# EAGLE design main (EAGLE 9.6.2)
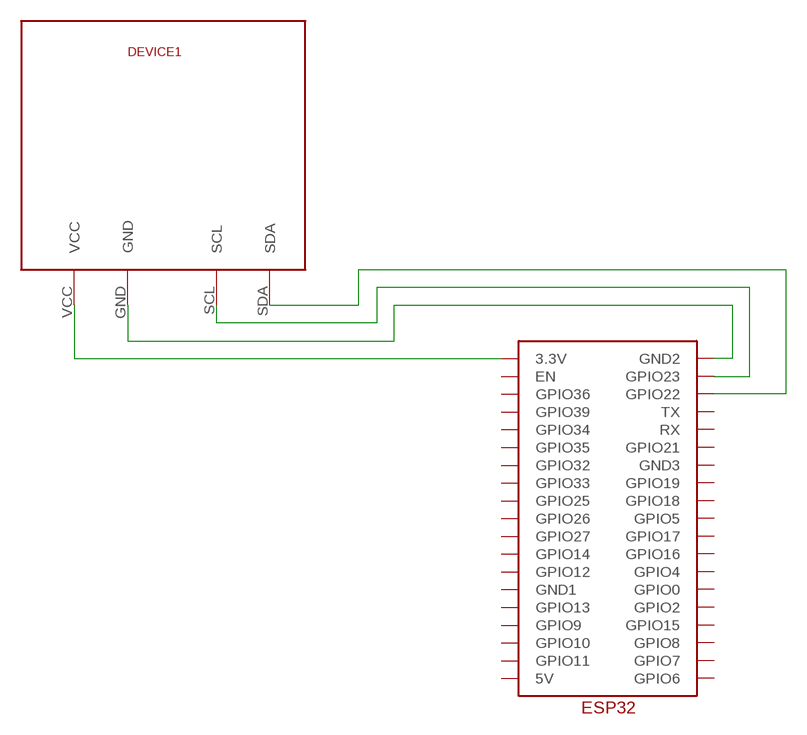
[diagram p0: schematic, sheet 1]

## Parts
U$1  DEVICE1  [HEADER_DEVICE1]
U$2  ESP32  [ESP32]

## Nets
GND: U$1.GND U$2.GND2
SCL: U$1.SCL U$2.GPIO23
SDA: U$1.SDA U$2.GPIO22
VCC: U$1.VCC U$2.3.3V
Unconnected: U$2.5V U$2.EN U$2.GND1 U$2.GND3 U$2.GPIO0 U$2.GPIO2 U$2.GPIO4 U$2.GPIO5 U$2.GPIO6 U$2.GPIO7 U$2.GPIO8 U$2.GPIO9 U$2.GPIO10 U$2.GPIO11 U$2.GPIO12 U$2.GPIO13 U$2.GPIO14 U$2.GPIO15 U$2.GPIO16 U$2.GPIO17 U$2.GPIO18 U$2.GPIO19 U$2.GPIO21 U$2.GPIO25 U$2.GPIO26 U$2.GPIO27 U$2.GPIO32 U$2.GPIO33 U$2.GPIO34 U$2.GPIO35 U$2.GPIO36 U$2.GPIO39 U$2.RX U$2.TX

## Library data of the parts
U$1 = my_devices:DEVICE1
U$2 = ESP32:ESP32

## Board
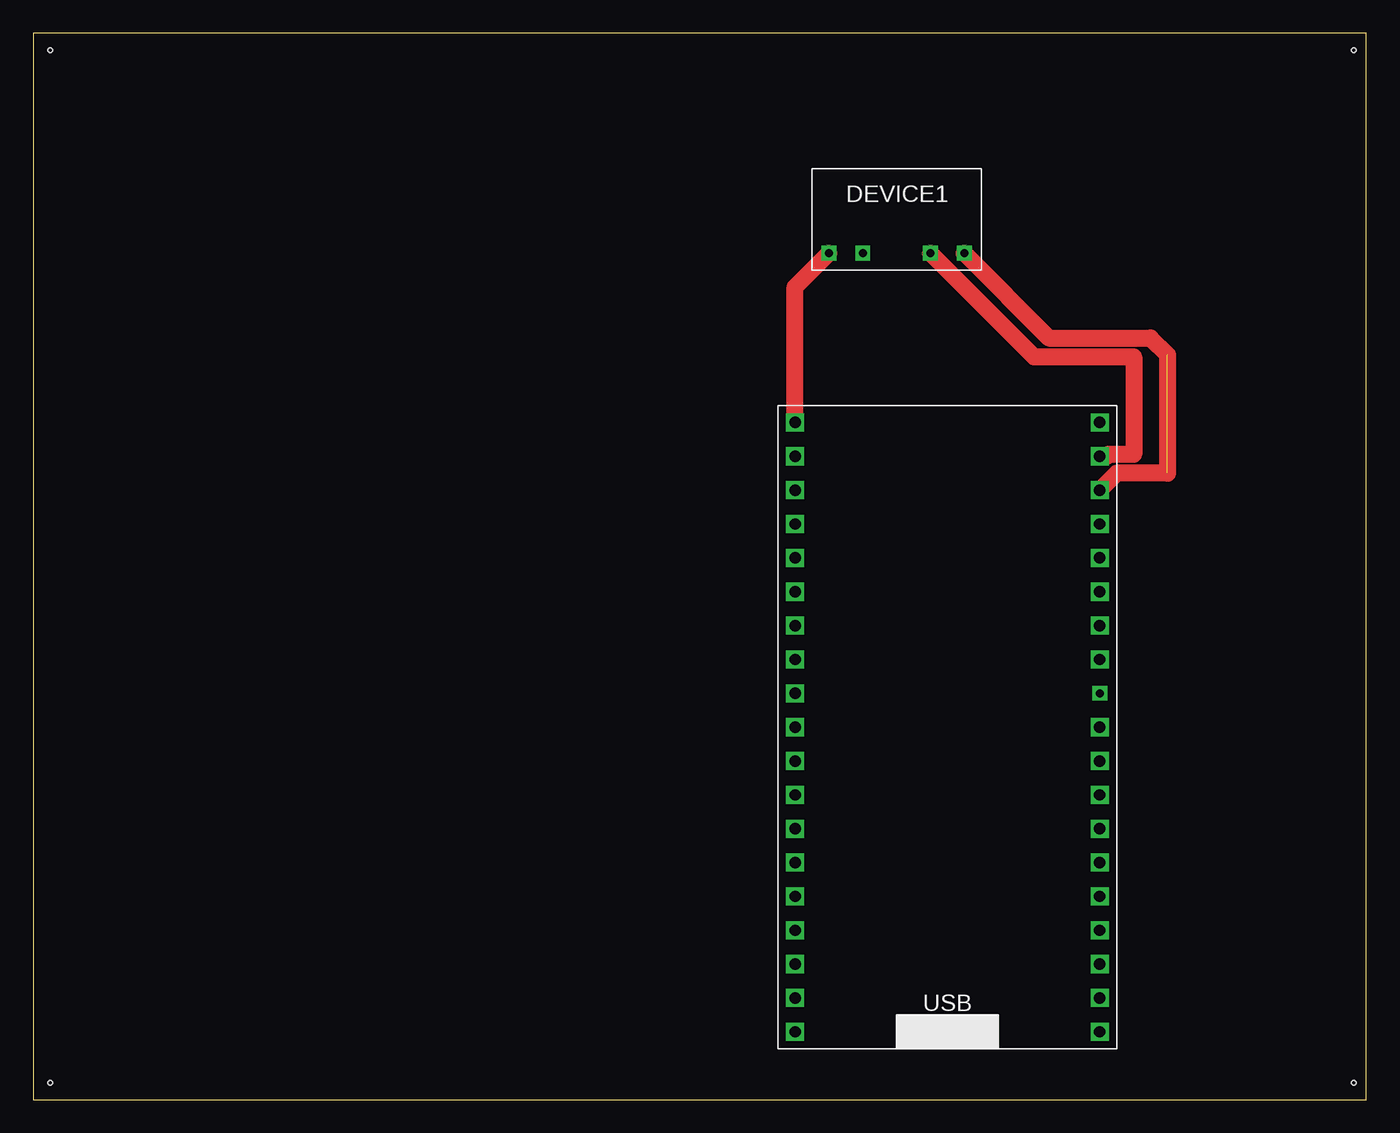
[diagram p1: board, top side]
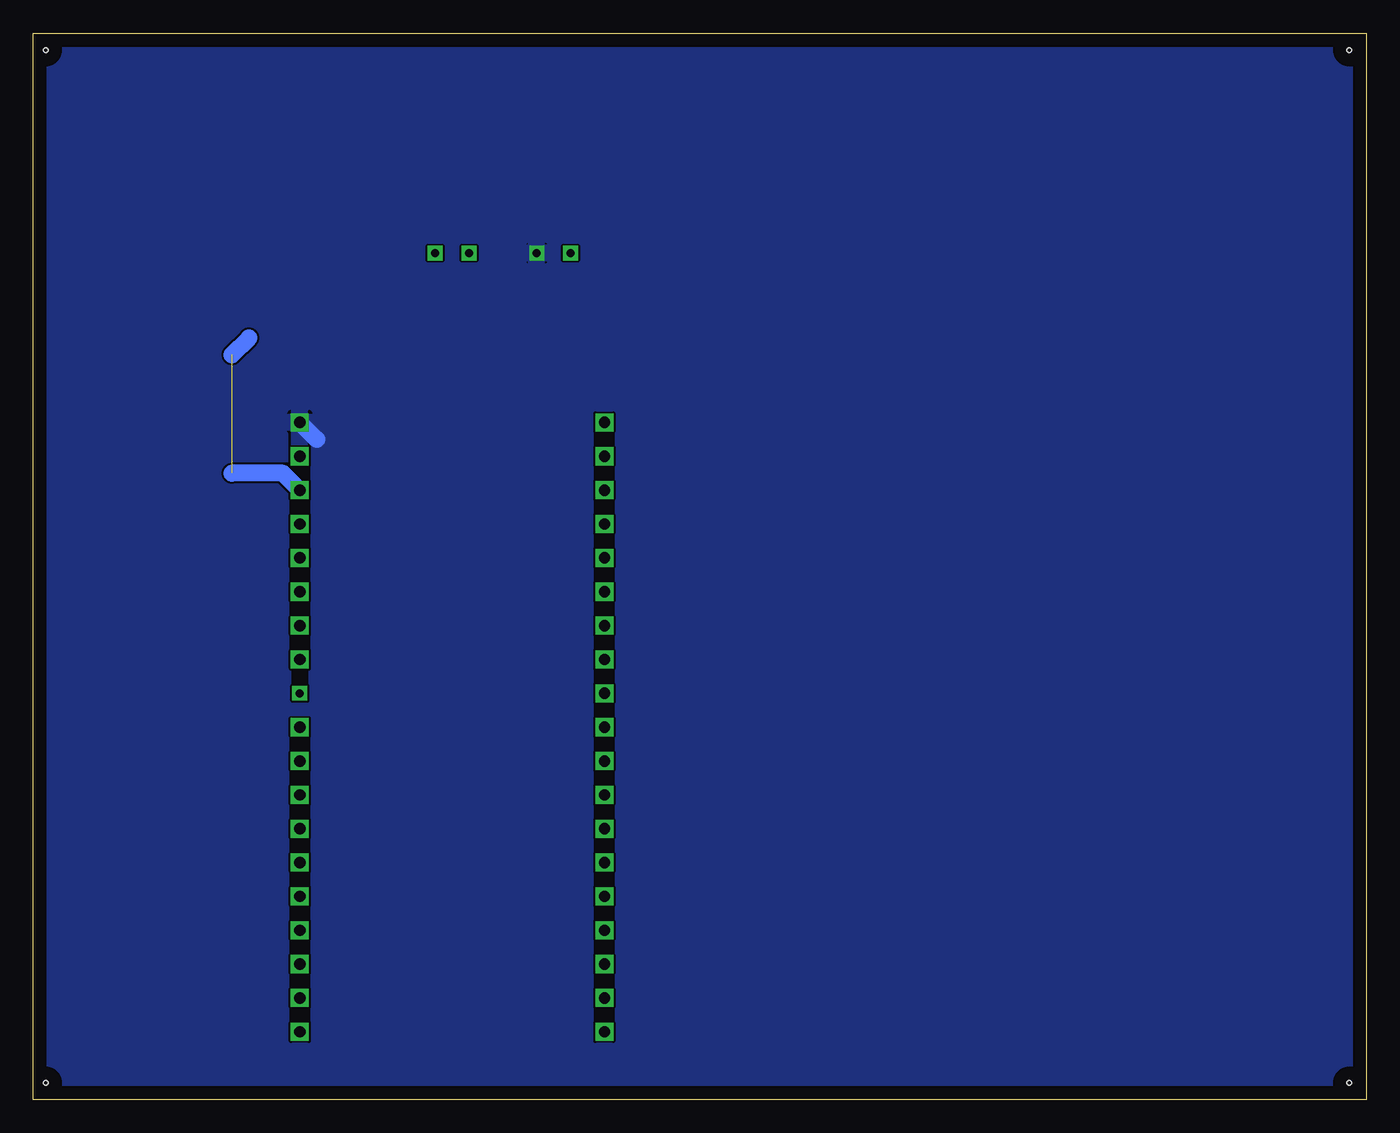
[diagram p2: board, bottom side, seen from below]

Size 100 x 80 mm. Coordinates in mm from the lower left corner, seen from the top.
Outline: 0,0 100,0 100,80 0,80 0,0
Copper layers (1*16): Top 0.035mm / dielectric 1.5mm / Bottom 0.035mm
Design rules "default": minimum track width 6mil, minimum drill 0.35mm, track to track 6mil, track to pad 6mil, pad to pad 6mil, via to via 6mil, smd to smd 6mil, copper to edge 40mil, drill to drill 6mil, minimum pad ring 10mil, minimum via ring 8mil, stop-mask expansion 4mil, vias tented up to drill 0mil, thermal gap 10mil
Holes 0.35 mm at 1.27,1.27 99.06,1.27 99.06,78.74 1.27,78.74

### Footprints (pad centres in the part's own frame; a part is rotated, then mirrored left to right if it is on the bottom)
HEADER_DEVICE1 = drill 0.6 square: GND -2.54,1.27; SCL 2.54,1.27; SDA 5.08,1.27; VCC -5.08,1.27
ESP32 = drill 0.85 square: 3.3V 1.27,46.99; 5V 1.27,1.27; EN 1.27,44.45; GND1 1.27,13.97; GND2 24.13,46.99; GND3 24.13,31.75; GPIO0 24.13,13.97; GPIO2 24.13,11.43; GPIO4 24.13,16.51; GPIO5 24.13,24.13; GPIO6 24.13,1.27; GPIO7 24.13,3.81; GPIO8 24.13,6.35; GPIO9 1.27,8.89; GPIO10 1.27,6.35; GPIO11 1.27,3.81; GPIO12 1.27,16.51; GPIO13 1.27,11.43; GPIO14 1.27,19.05; GPIO15 24.13,8.89; GPIO16 24.13,19.05; GPIO17 24.13,21.59; GPIO19 24.13,29.21; GPIO21 24.13,34.29; GPIO22 24.13,41.91; GPIO23 24.13,44.45; GPIO25 1.27,26.67; GPIO26 1.27,24.13; GPIO27 1.27,21.59; GPIO32 1.27,31.75; GPIO33 1.27,29.21; GPIO34 1.27,36.83; GPIO35 1.27,34.29; GPIO36 1.27,41.91; GPIO39 1.27,39.37; RX 24.13,36.83; TX 24.13,39.37 | drill 0.6 square: GPIO18 24.13,26.67

### Placement (x,y rotation side)
U$1  64.77,62.23 0 top
U$2  55.88,3.81 0 top

### Tracks (layer width: path | path; a pad name or v marks a point on that pad's centre or on a via)
GND
  Bottom 1.27: U$2.GND2 78.74,49.53
  pour Bottom: 0,80.01 0,0 100.33,0 100.33,80.01
SCL
  Top 1.27: U$1.SCL 75.08,55.73 82.55,55.73 82.55,48.41 80.69,48.41 80.54,48.26 U$2.GPIO23
SDA  (1 unrouted)
  Top 1.27: U$1.SDA 76.2,57.15 83.82,57.15 85.09,55.88 85.09,46.99 81.28,46.99 U$2.GPIO22
  Bottom 1.27: U$2.GPIO22 81.28,46.99 85.09,46.99 | 85.09,55.88 83.82,57.15
VCC
  Top 1.27: U$2.3.3V 57.15,60.96 U$1.VCC